# Altium schematic sheet STeaMi-FP3-Jauge_Batterie.SchDoc
size A3; DocumentNumber: 1; SheetNumber: 4; SheetTotal: 16
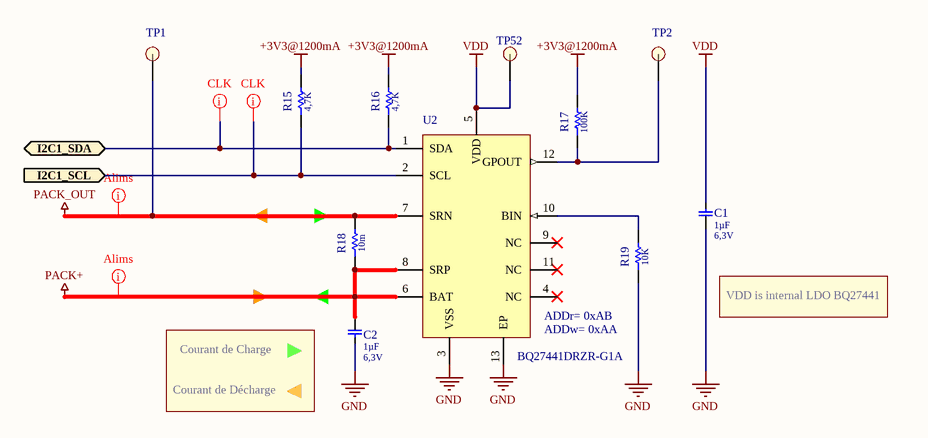
[diagram p0: STeaMi-FP3-Jauge_Batterie.SchDoc]

## Parts
C1  Capacitance: 1µF  Voltage: 6,3V  [0402-CAP]
C2  Capacitance: 1µF  Voltage: 6,3V  [0402-CAP]
R15  Resistance: 4,7K  [RESC1005X40N_0402]
R16  Resistance: 4,7K  [RESC1005X40N_0402]
R17  Resistance: 100K  [RESC1005X40N_0402]
R18  Resistance: 10m  [RESC1005X40N_0402]
R19  Resistance: 10K  [RESC1005X40N_0402]
TP1  PAD  [Testpoint 1mm]  (value not drawn)  (no BOM)
TP2  PAD  [Testpoint 1mm]  (value not drawn)  (no BOM)
TP52  PAD  [Testpoint 1mm]  (value not drawn)  (no BOM)
U2  (no value)  [BQ27441DRZRG1A]

## Ports
I2C1_SCL (in), I2C1_SDA (bidir)

## Nets
+3V3@1200mA: R15.2 R16.2 R17.2
GND: C1.1 C2.2 R19.1 U2.3(VSS) U2.13(EP)
PACK+: C2.1 R18.1 U2.6(BAT) U2.8(SRP)
PACK_OUT: R18.2 TP1.1 U2.7(SRN)
VDD: C1.2 TP52.1 U2.5(VDD)
I2C1_SCL: R15.1 U2.2(SCL) ; port I2C1_SCL
I2C1_SDA: R16.1 U2.1(SDA) ; port I2C1_SDA
NetR17_1: R17.1 TP2.1 U2.12(GPOUT)
NetR19_2: R19.2 U2.10(BIN)

Not connected (* = marked no-connect by the designer): U2 4(NC)* 9(NC)* 11(NC)*

## Layout directives
mark named CLK: I2C1_SCL, I2C1_SDA
net class Alims: PACK+, PACK_OUT

## Notes on the sheet
- (near U2) ADDr= 0xAB
- VDD is internal LDO BQ27441
- Courant de Charge
- (near U2) ADDw= 0xAA
- Courant de Décharge
- Le présent document est la propriété exclusive de SmartEmbed. Remis à titre confidentiel, il ne peut être communiqué
- IND
- DATE
- DESCRIPTION
- VISA
- à des tiers, ni utilisé ou reproduit qu'en stricte conformité d'autorisations expresses préalables.
- Etabli le:
- Verifié le:
- Validé le:
- Par:
- Page:
- /
- Pépinière CleanTech Domaine du Petit Arbois Avenue Louis Philibert BP 80058 13792 AIX-EN-PROVENCE CEDEX 3
- REFERENCE
- DESIGNATION

## Library data of the parts
C1 C2 = 1µF-10%-6,3V-X5R-0402: CAP CER 1µF 6,3V X5R 0402; Manufacturer: Taiyo Yuden; Manufacturer Part Number: JMK105BJ105KV-F; Populated: True; std Package: 0402; Tolerence: 0,1; Vérification: Non; Created by: EAG; Creation Date: 08/04/2021; Checked by: *; Part Number: 1µF-10%-6,3V-X5R-0402; Dielectric: X5R; Mouser: 963-JMK105BJ105KV-F; Switch possibility: True
R15 R16 = 4,7K-5%-0,0625W-0402: RES CMS 4,7K5%-0,0625W-0402 ±100ppm/°C; Manufacturer: Yageo; Manufacturer Part Number: AC0402JR-074K7L; Populated: True; Power: 0,0625; Nom vérificateur: Non; Prix: 0,09; std Package: 0402; Tolerence: 0,05; Created by: EAG; Creation Date: 02/12/2021; Part Number: 4,7K-5%-0,0625W-0402; Digikey: 311-4.7KLBDKR-ND; Farnell: 3495221; Mouser: 603-AC0402JR-074K7L; Switch possibility: True
R17 = 100K-5%-0,0625W-0402: RES CMS 100K5%-0,0625W-0402 ±100ppm/°C; Manufacturer: Yageo; Manufacturer Part Number: RC0402JR-07100KL; Populated: True; Power: 0,0625; Nom vérificateur: Non; Prix: 0,09; std Package: 0402; Tolerence: 0,05; Created by: EAG; Creation Date: 02/12/2021; Part Number: 100K-5%-0,0625W-0402; Digikey: 311-100KJRCT-ND; Farnell: 9233008; Switch possibility: True
R18 = 10m-1%-0,2W-0402: RES CMS 10m1%-0,2W-0402 ±0ppm/°C; Manufacturer: Panasonic; Manufacturer Part Number: ERJ-2LWFR010X; Populated: True; Power: 0,2; Nom vérificateur: Non; Prix: 0,033; std Package: 0402; Switch possibility: False; Tolerence: 1%; Created by: EAG; Creation Date: 27/04/2021; Part Number: 10m-1%-0,2W-0402; Mouser: 667-ERJ-2LWFR010X
R19 = 10K-1%-0,0625W-0402: RES CMS 10K1%-0,0625W-0402 ±100ppm/°C; Manufacturer: Yageo; Manufacturer Part Number: AC0402FR-1310KL; Populated: True; Power: 0,0625; Nom vérificateur: Non; Prix: 0,088; std Package: 0402; Tolerence: 0,01; Created by: EAG; Creation Date: 08/06/2021; Part Number: 10K-1%-0,0625W-0402; Mouser: 603-AC0402FR-1310KL; Switch possibility: True
TP1 TP2 TP52 = TESTPOINTPAD: Manufacturer: Smartembed; Switch possibility: False; Vérification: Non; Package: PAD_TEST; Part Number: TESTPOINTPAD; Created by: EAG; Creation Date: 11/03/2020; Digikey: -; Farnell: -; Manufacturer Part Number: TESTPOINT; Mouser: -; RS: -
U2 = BQ27441DRZR-G1A: LiCoO2, Li-Ion, Indicateur de charge batterie, alimentation 2.45 V à 4.5 V, interface I2C, SON-12; Manufacturer: Texas Instruments; Populated: False; Switch possibility: False; Vérification: Non; Created by: MSA; Creation Date: 28/08/2018; Checked by: *; Manufacturer Part Number: BQ27441DRZR-G1A; Part Number: BQ27441DRZR-G1A; Digikey: 296-37271-1-ND; Farnell: 2400942; Mouser: 595-BQ27441DRZR-G1A